# EAGLE design 556 (EAGLE 9.6.2)
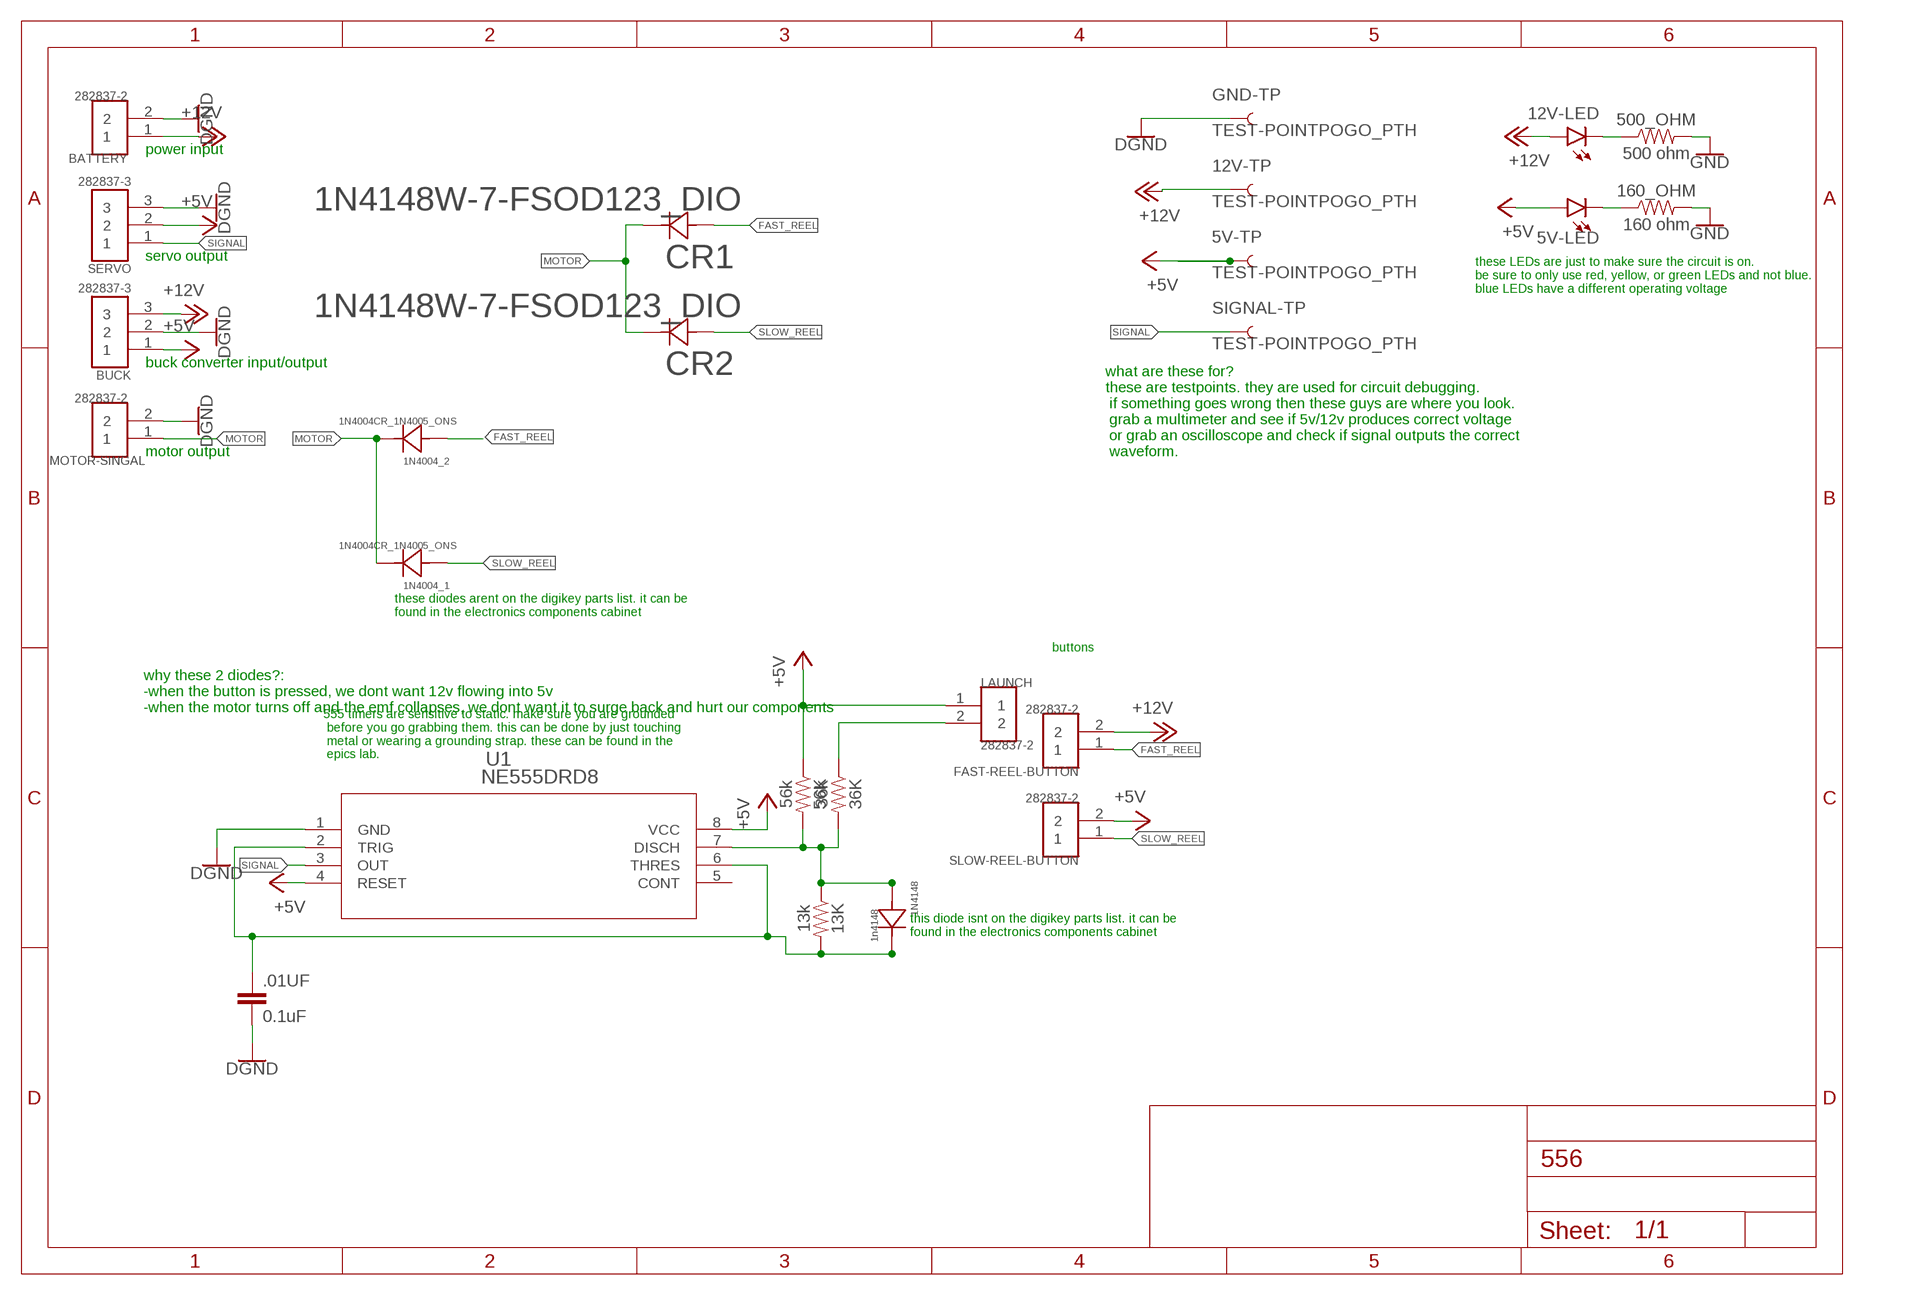
[diagram p0: schematic, sheet 1]

## Parts
1N4004_1  1N4004CR_1N4005_ONS  [CR_1N4005_ONS]
1N4004_2  1N4004CR_1N4005_ONS  [CR_1N4005_ONS]
1N4148  1n4148  1N4004CR_1N4005_ONS  [CR_1N4005_ONS]
5V-LED  LED0603  [LED-0603]
5V-TP  TEST-POINTPOGO_PTH  [1X01_NO_SILK]
12V-LED  LED0603  [LED-0603]
12V-TP  TEST-POINTPOGO_PTH  [1X01_NO_SILK]
13K  13k  1.8MOHM  [0603]
36K  36k  1.8MOHM  [0603]
56K  56k  1.8MOHM  [0603]
160_OHM  160 ohm  1.8MOHM  [0603]
500_OHM  500 ohm  1.8MOHM  [0603]
.01UF  0.1uF  .1UF-CER  [0402-CAP]
BATTERY  282837-2  [TE_282837-2]
BUCK  282837-3  [TE_282837-3]
CR1  1N4148W-7-FSOD123_DIO  [SOD123_DIO]
CR2  1N4148W-7-FSOD123_DIO  [SOD123_DIO]
FAST-REEL-BUTTON  282837-2  [TE_282837-2]
GND-TP  TEST-POINTPOGO_PTH  [1X01_NO_SILK]
LAUNCH  282837-2  [TE_282837-2]
MOTOR-SINGAL  282837-2  [TE_282837-2]
SERVO  282837-3  [TE_282837-3]
SIGNAL-TP  TEST-POINTPOGO_PTH  [1X01_NO_SILK]
SLOW-REEL-BUTTON  282837-2  [TE_282837-2]
U1  NE555DRD8  [D8]

## Nets
+5V: 5V-LED.A 5V-TP.1 56K.1 BUCK.1 LAUNCH.1 SERVO.2 SLOW-REEL-BUTTON.2 U1.4(RESET) U1.8(VCC)
+12V: 12V-LED.A 12V-TP.1 BATTERY.1 BUCK.3 FAST-REEL-BUTTON.2
FAST_REEL: 1N4004_2.2 CR1.2 FAST-REEL-BUTTON.1
GND: 160_OHM.2 500_OHM.2 .01UF.2 BATTERY.2 BUCK.2 GND-TP.1 MOTOR-SINGAL.2 SERVO.3 U1.1(GND) ; supply symbol labelled DGND
MOTOR: 1N4004_1.1 1N4004_2.1 CR1.1 CR2.1 MOTOR-SINGAL.1
N$1: 36K.1 LAUNCH.2
N$2: 1N4148.1 13K.2 .01UF.1 U1.2(TRIG) U1.6(THRES)
N$3: 1N4148.2 13K.1 36K.2 56K.2 U1.7(DISCH)
N$5: 5V-LED.C 160_OHM.1
N$6: 12V-LED.C 500_OHM.1
SIGNAL: SERVO.1 SIGNAL-TP.1 U1.3(OUT)
SLOW_REEL: 1N4004_1.2 CR2.2 SLOW-REEL-BUTTON.1
Unconnected: U1.5(CONT)

## Notes on the sheet
- power input
- servo output
- these LEDs are just to make sure the circuit is on. 
  be sure to only use red, yellow, or green LEDs and not blue.
  blue LEDs have a different operating voltage
- buck converter input/output
- motor output
- what are these for?
  these are testpoints. they are used for circuit debugging.
   if something goes wrong then these guys are where you look.
   grab a multimeter and see if 5v/12v produces correct voltage
   or grab an oscilloscope and check if signal outputs the correct
   waveform.
- these diodes arent on the digikey parts list. it can be 
  found in the electronics components cabinet
- buttons
- why these 2 diodes?:
  -when the button is pressed, we dont want 12v flowing into 5v
  -when the motor turns off and the emf collapses, we dont want it to surge back and hurt our components
- 555 timers are sensitive to static. make sure you are grounded
   before you go grabbing them. this can be done by just touching
   metal or wearing a grounding strap. these can be found in the
   epics lab.
- this diode isnt on the digikey parts list. it can be 
  found in the electronics components cabinet

## Library data of the parts
1N4004_1 1N4004_2 1N4148 = 2023-11-08_17-09-45_Library:1N4004; COPYRIGHT: Copyright (C) 2023 Ultra Librarian. All rights reserved.; MANUFACTURER_PART_NUMBER: 1N4004; MFR_NAME: onsemi / Fairchild Semiconductor
5V-LED 12V-LED = SparkFun-LED:LED: LED (Generic) Standard schematic elements and footprints for 5mm, 3mm, 1206, and 0603 sized LEDs. Generic LEDs with no color specified.
5V-TP 12V-TP GND-TP SIGNAL-TP = SparkFun-Connectors:TEST-POINT: SparkFun Test Points Bare copper test points for troubleshooting or In-Circuit-Testing. These are used by our Production team for verifying production board runs using pogo-pins on test beds. SparkFun Products: SparkFun LSM9DS1 Breakout <https://www.sparkfun.com/products/13284> SparkFun PSOC <https://www.sparkfun.com/products/13714> SparkFun Load Cell Amplifier <https://www.sparkfun.com/products/13879>
13K 36K 56K 160_OHM 500_OHM = SparkFun-Resistors:1.8MOHM: 1.8 MOhms ±5% 0.1W, 1/10W Chip Resistor 0603; PROD_ID: RES-13994; VALUE: 1.8M
.01UF = SparkFun-Retired:.1UF-CER: .1uF ceramic SMT CAP-00810- 25V +80%/-20% (0603) CAP-08390- 100V 10% (0603) CAP-08604- 25V 5% (0603); PROD_ID: CAP-00810
BATTERY FAST-REEL-BUTTON LAUNCH MOTOR-SINGAL SLOW-REEL-BUTTON = 282837-2:282837-2: TERM BLOCK 5.08MM 2POS SIDE ENTY; CHECK_PRICES: https://www.snapeda.com/parts/282837-2/TE+Connectivity+AMP+Connectors/view-part/?ref=eda; COMMENT: 282837-2; DESCRIPTION: Terminal Block Connector Wire Receptacle 2 5.08 mm 30-16 AWG Green 13.5 A 250 V | TE Connectivity 282837-2; DIGIKEY_PART_NUMBER: A113320-ND; MF: TE Connectivity; MP: 282837-2; PACKAGE: None; PURCHASE-URL: https://www.snapeda.com/api/url_track_click_mouser/?unipart_id=2549980&manufacturer=TE Connectivity&part_name=282837-2&search_term=None; SNAPEDA_LINK: https://www.snapeda.com/parts/282837-2/TE+Connectivity+AMP+Connectors/view-part/?ref=snap
BUCK SERVO = 282837-3:282837-3: TERMI-BLOK PCB MOUNT 3P; MANUFACTURER: TE CONNECTIVITY; PARTREV: H; STANDARD: Manufacturer Recommendations
CR1 CR2 = 2023-12-18_01-28-32_Library:1N4148W-7-F; COPYRIGHT: Copyright (C) 2023 Ultra Librarian. All rights reserved.; MANUFACTURER_PART_NUMBER: 1N4148W-7-F; MFR_NAME: Diodes Inc
U1 = 2023-11-08_16-37-11_Library:NE555DR; COPYRIGHT: Copyright (C) 2023 Ultra Librarian. All rights reserved.; MANUFACTURER_PART_NUMBER: NE555DR; MFR_NAME: Texas Instruments

## Board
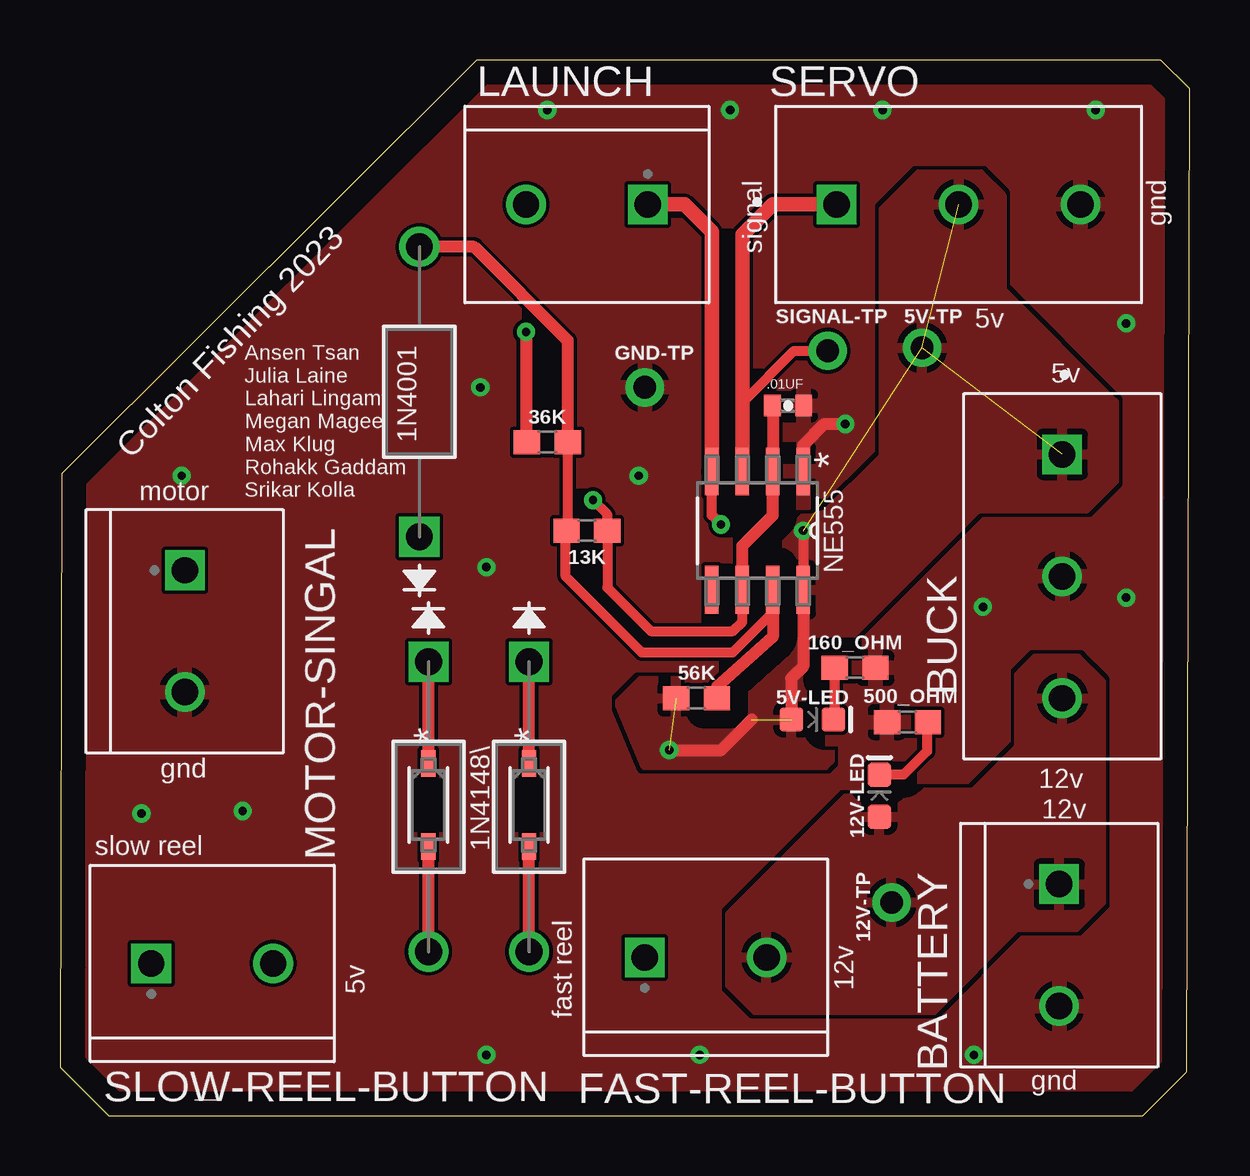
[diagram p1: board, top side]
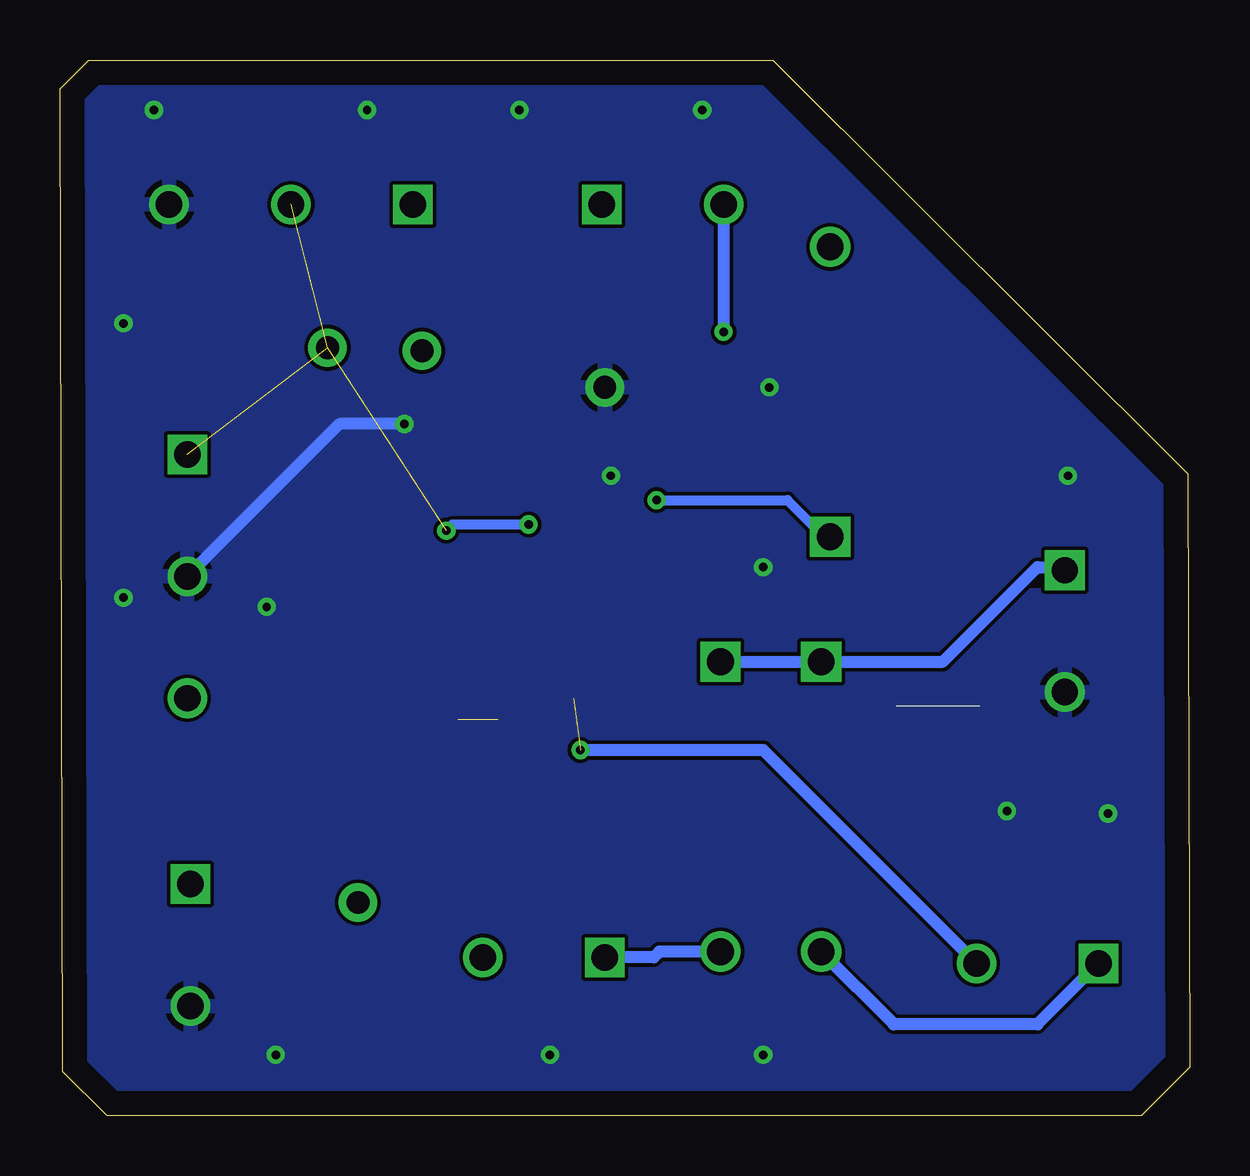
[diagram p2: board, bottom side, seen from below]

Size 47.09 x 43.99 mm. Coordinates in mm from the lower left corner, seen from the top.
Outline: 0.07,26.75 0,2.03 2.02,0 45.13,0 46.97,1.84 47.09,42.8 45.89,43.99 17.36,43.99 0.07,26.75
Copper layers (1*16): Top 0.035mm / dielectric 1.5mm / Bottom 0.035mm
Design rules "477": minimum track width 6mil, minimum drill 0.35mm, track to track 6mil, track to pad 6mil, pad to pad 6mil, via to via 6mil, smd to smd 6mil, copper to edge 40mil, drill to drill 6mil, minimum pad ring 10mil, minimum via ring 8mil, stop-mask expansion 4mil, vias tented up to drill 0mil, thermal gap 10mil

### Footprints (pad centres in the part's own frame; a part is rotated, then mirrored left to right if it is on the bottom)
CR_1N4005_ONS = drill 1.118 pad 1.626 square: 1 0,0 | drill 1.118 pad 1.626: 2 12.08,0
LED-0603 = smd 1 x 1: A -0.877,0; C 0.877,0
1X01_NO_SILK = drill 0.95 pad 1.6: 1 0,0
0603 = smd 1.1 x 1: 1 -0.85,0; 2 0.85,0
0402-CAP = smd 0.7 x 0.9: 1 -0.65,0; 2 0.65,0
TE_282837-2 = drill 1.1 square: 1 -2.54,0 | drill 1.1: 2 2.54,0
TE_282837-3 = drill 1.1 square: 1 -5.08,0 | drill 1.1: 2 0,0; 3 5.08,0
SOD123_DIO = smd 1.111 x 0.601: 1 -1.725,0; 2 1.725,0
D8 = smd 1.981 x 0.559: 1 -2.464,1.905; 2 -2.464,0.635; 3 -2.464,-0.635; 4 -2.464,-1.905; 5 2.464,-1.905; 6 2.464,-0.635; 7 2.464,0.635; 8 2.464,1.905

### Placement (x,y rotation side)
1N4004_1  15.36,18.92 270 top
1N4004_2  19.55,18.92 270 top
1N4148  14.98,24.13 90 top
5V-LED  31.36,16.51 0 top
5V-TP  35.94,32 0 top
12V-LED  34.16,13.34 90 top
12V-TP  34.67,8.89 0 top
13K  21.97,24.38 0 top
36K  20.31,28.07 0 top
56K  26.54,17.4 0 top
160_OHM  33.14,18.67 0 top
500_OHM  35.33,16.41 180 top
.01UF  30.35,29.59 0 top
BATTERY  41.65,7.11 270 top
BUCK  41.78,22.48 270 top
CR1  19.55,12.95 270 top
CR2  15.36,12.95 270 top
FAST-REEL-BUTTON  26.92,6.6 0 top
GND-TP  24.38,30.35 0 top
LAUNCH  21.97,37.97 180 top
MOTOR-SINGAL  5.2,20.19 270 top
SERVO  37.46,37.97 0 top
SIGNAL-TP  32,31.88 0 top
SLOW-REEL-BUTTON  6.34,6.35 0 top
U1  29.08,24.38 270 top

### Tracks (layer width: path | path; a pad name or v marks a point on that pad's centre or on a via)
+5V  (via drill 0.35)  (5 unrouted)
  Top 0.406: v27.55,24.64 27.17,25.02 U1.4 | v30.98,24.38 U1.8
  Top 0.508: U1.8 30.98,18.72 30.49,18.22 5V-LED.A | v25.39,15.24 27.55,15.24 28.82,16.51
  Top 0.61: LAUNCH.1 26.03,37.97 27.17,36.83 U1.4
  Bottom 0.406: v27.55,24.64 30.73,24.64 v30.98,24.38
  Bottom 0.508: SLOW-REEL-BUTTON.2 17.77,15.24 v25.39,15.24
  pour Top (isolate 0.762): 35.81,39.24 38.35,39.24 39.24,38.35 39.24,34.42 43.94,29.72 43.94,26.47 42.77,25.3 38.25,25.3 32.07,19.13 32.07,14.81 31.87,14.61 24.39,14.61 23.31,17.22 31.11,25.02 31.87,25.02 34.33,27.48 34.33,37.77
+12V
  pour Top (isolate 0.762): 39.87,7.87 42.36,7.87 43.4,8.92 43.4,18.06 42.41,19.05 40.66,19.05 39.97,18.36 39.97,15.37 38.07,13.46 33.01,13.46 27.93,8.38 27.93,5.46 28.98,4.42 36.42,4.42
FAST_REEL
  Top 0.508: 1N4004_2.2 CR1.2
  Bottom 0.508: 1N4004_2.2 22.11,6.84 22.35,6.6 FAST-REEL-BUTTON.1
GND  (via drill 0.35)
  Top 0.508: U1.1 30.98,27.94 31.87,28.83 v32.74,28.83
  Bottom 0.508: v32.74,28.83 35.43,28.83 BUCK.2
  other vias: 3.4,12.6 5.07,26.67 17.77,22.86 17.52,30.35 20.31,41.91 24.12,26.67 7.61,12.7 17.77,2.54 26.66,2.54 38.09,2.54 44.44,21.59 38.48,21.21 44.44,33.02 43.17,41.91 34.28,41.91 27.93,41.91
  pour Top (rank 5): 48.25,45.72 15.97,45.72 -5.09,24.66 -5.09,-2.54 -3.82,-3.81 48.25,-3.81 49.52,44.45
  pour Bottom (rank 5): 16.2,46.99 -6.36,24.43 -6.36,1.27 -0.01,-5.08 45.71,-5.08 48.25,-2.54 48.25,46.99
MOTOR
  Top 0.508: CR1.1 1N4004_2.1 | CR2.1 1N4004_1.1
  Bottom 0.508: 1N4004_2.1 1N4004_1.1 10.28,18.92 6.34,22.86 5.33,22.86 MOTOR-SINGAL.1
N$1  (via drill 0.35)
  Top 0.508: v19.43,32.66 19.43,28.11 36K.1
  Bottom 0.508: LAUNCH.2 v19.43,32.66
N$2  (via drill 0.35)
  Top 0.406: U1.6 28.44,20.57 28.06,20.19 24.63,20.19 22.82,22.01 13K.2 22.82,25.06 v22.22,25.65
  Top 0.508: .01UF.1 29.71,29.58 U1.2 29.71,25.02 28.44,23.75 U1.6
  Bottom 0.406: v22.22,25.65 16.76,25.65 15.23,24.13 1N4148.1
N$3
  Top 0.406: U1.7 29.71,20.98 28.04,19.3 24.25,19.3 21.08,22.48 21.08,24.34 13K.1 21.16,24.43 36K.2
  Top 0.508: U1.7 29.71,19.95 27.39,17.89 56K.2 | 1N4148.2 17.25,36.21 21.16,32.3 36K.2
N$5
  Top 0.406: 160_OHM.1 32.29,16.56 5V-LED.C
N$6
  Top 0.406: 500_OHM.1 36.14,16.37 36.14,15.19 35.16,14.21 12V-LED.C
SIGNAL
  Top 0.406: 28.44,29.21 28.44,29.72 30.6,31.88 SIGNAL-TP.1
  Top 0.61: U1.3 28.44,29.21 28.44,36.7 29.71,37.97 SERVO.1
SLOW_REEL
  Top 0.508: 1N4004_1.2 CR2.2
  Bottom 0.508: SLOW-REEL-BUTTON.1 6.34,3.81 12.33,3.81 1N4004_1.2

### Text on the board
Unrouted: testpoint / LED location doesnt matter much. just put them where / you can access them. test points will be on top and bottom but / just make sure to leave space for the LEDs to go in. | you could be thinking, 'hey julia wait, these are both grounds and / connected! why is there a trace here when theyre both on the / same gnd polygon?' / / well, i thought the same thing! eagle and i were not on the same / page and eagle believed they were not. to make sure we are on / the same page as eagle, download the error analysis file thing in / the electrical file. go to tools, drc, upload file, and use this file. this / error analysis tells you stuff like this so your board doesnt surprise / you when you print it! | these are ground polygons. they make the / whole board ground unless there are traces / over it. when you make these, give them a / low rank (like 6) so they dont mess with / your other polygons. remember to add vias / so the potential is 0 at both sides. | when making polygons to connect a bunch / of signals, youre going to want to 'isolate' / them. right click and select properties. i / make all power signals isolated by 30 | polygons on opposite sides can overlap. to see the polygon / connections / isolation, type ratsnest up top. you can also / access the command line quickly with Ctrl+L | to see a cute photo of what the board is gonna look like printed, / click the manufacturing tab in the far right. it will show you a png. / this is useful for seeing text thats on the pcb. its also nice to put / in your work/accomplishments. / / if anyone actually ever reads this, i am a lab / ta for spring 2024 (and maybe future semesters) / and i would love to see ur future pcbs so come say hey | once you have done ratsnest, all the polygons will be filled. to get / rid of them since they are annoying, type ripup and then select "all / polygons" below for banishing all of them back to the dotted line / state. if you want to ripup just 1 signal, do ripup @ [signal]
tNames: signal | gnd | 5v | 5v | 1N4001 | Colton Fishing 2023 | motor | NE555 | Ansen Tsan / Julia Laine / Lahari Lingam / Megan Magee / Max Klug / Rohakk Gaddam / Srikar Kolla | gnd | 12v | 12v | slow reel | 1N4148\ | 12v | 5v | fast reel | gnd